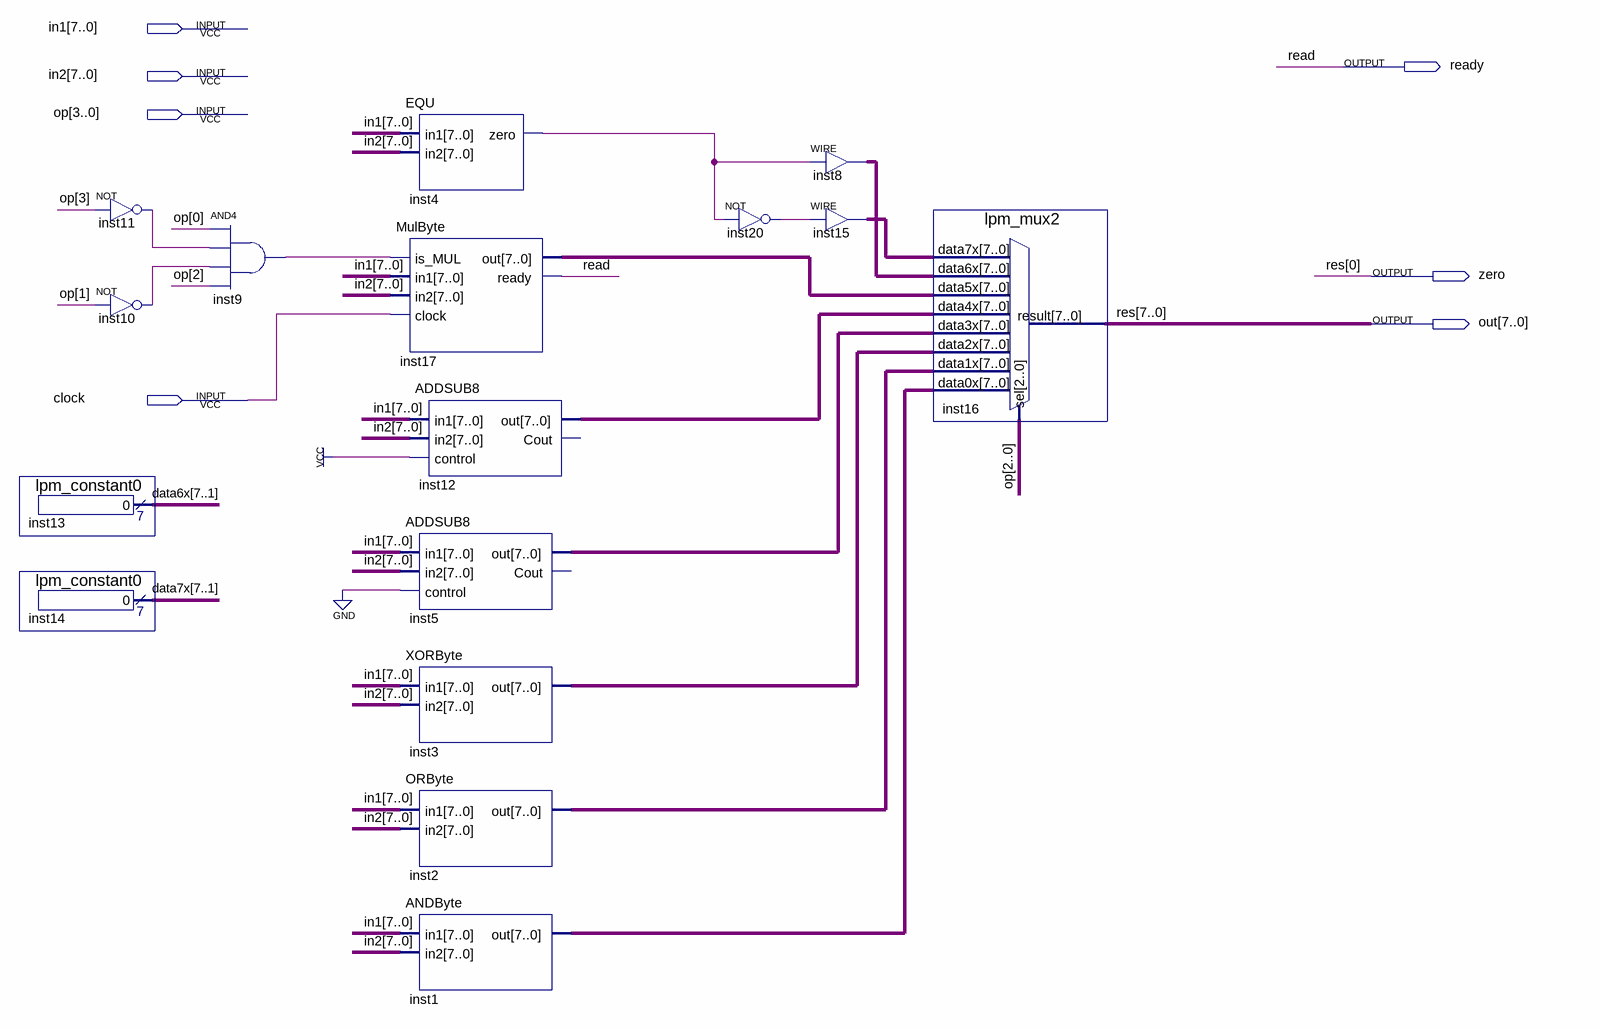
[diagram p0: schematic sheet]
// Quartus schematic ALU.bdf as structural Verilog: 16 symbols, 7 pins
module ALU (
  input  [7:0] in1,
  input  [7:0] in2,
  input  [3:0] op,
  input  clock,
  output ready,
  output zero,
  output [7:0] out
);

  wire inst4_zero, inst9_out, inst10_out, inst11_out, inst20_out;
  wire [7:0] inst1_out, inst2_out, inst3_out, inst5_out, inst8_out, inst12_out, inst15_out, inst17_out;
  wire [7:1] data6x, data7x;

  lpm_constant0 inst13 (.result(data6x));
  lpm_constant0 inst14 (.result(data7x));
  not inst11 (inst11_out, op[3]);
  not inst10 (inst10_out, op[1]);
  and inst9 (inst9_out, op[0], inst11_out, inst10_out, op[2]);
  EQU inst4 (.in1(in1), .in2(in2), .zero(inst4_zero));
  MulByte inst17 (.is_MUL(inst9_out), .in1(in1), .in2(in2), .clock(clock), .out(inst17_out), .ready(ready));
  ADDSUB8 inst5 (.in1(in1), .in2(in2), .control(1'b0), .out(inst5_out));  // open: Cout
  XORByte inst3 (.in1(in1), .in2(in2), .out(inst3_out));
  ORByte inst2 (.in1(in1), .in2(in2), .out(inst2_out));
  ANDByte inst1 (.in1(in1), .in2(in2), .out(inst1_out));
  ADDSUB8 inst12 (.in1(in1), .in2(in2), .control(1'b1), .out(inst12_out));  // open: Cout
  not inst20 (inst20_out, inst4_zero);
  assign inst8_out = {8{inst4_zero}};  // WIRE inst8
  assign inst15_out = {8{inst20_out}};  // WIRE inst15
  lpm_mux2 inst16 (
    .data7x(inst15_out), .data6x(inst8_out), .data5x(inst17_out), .data4x(inst12_out), .data3x(inst5_out),
    .data2x(inst3_out), .data1x(inst2_out), .data0x(inst1_out), .sel(op[2:0]), .result(out));

  assign zero = out[0];

  // Other names for the same wires on the sheet: read = ready; res[7:0] = out
endmodule
